# EAGLE schematic v1.4 (EAGLE 9.6.2)
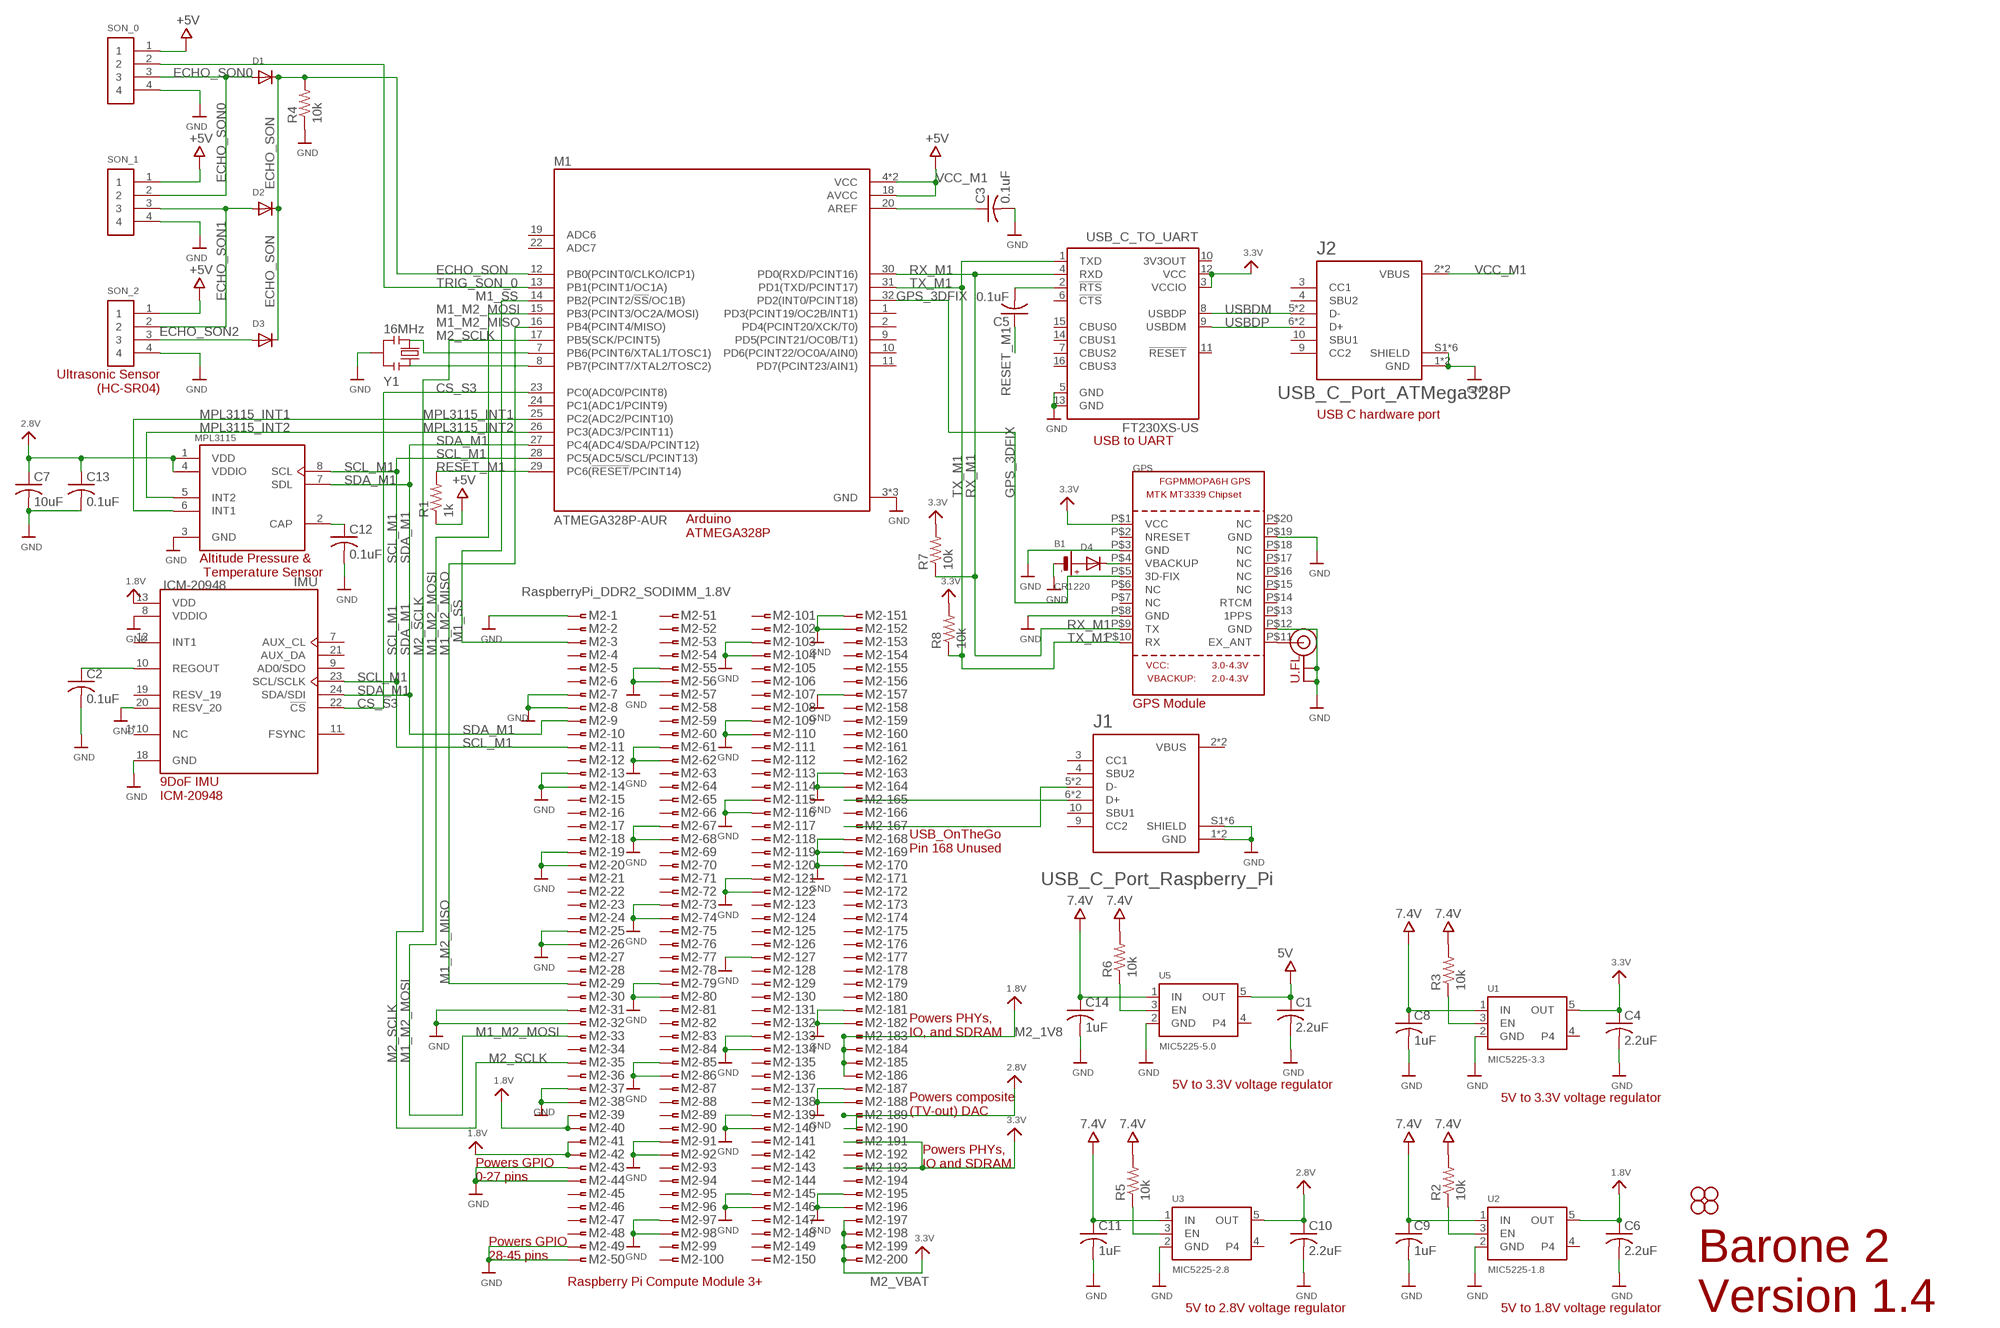
[diagram p0: schematic, sheet 1]

## Parts
B1  CR1220  BATTERYCR1220_SMT  [CR1220]
C1  2.2uF  C-USC0805  [C0805]
C2  0.1uF  C-USC0805  [C0805]
C3  0.1uF  C-USC0805  [C0805]
C4  2.2uF  C-USC0805  [C0805]
C5  0.1uF  C-USC0805  [C0805]
C6  2.2uF  C-USC0805  [C0805]
C7  10uF  C-USC0805  [C0805]
C8  1uF  C-USC0805  [C0805]
C9  1uF  C-USC0805  [C0805]
C10  2.2uF  C-USC0805  [C0805]
C11  1uF  C-USC0805  [C0805]
C12  0.1uF  C-USC0805  [C0805]
C13  0.1uF  C-USC0805  [C0805]
C14  1uF  C-USC0805  [C0805]
D1  DIODESOD-323F  [SOD-323F]
D2  DIODESOD-323F  [SOD-323F]
D3  DIODESOD-323F  [SOD-323F]
D4  DIODESOD-323F  [SOD-323F]
GPS  GPS_FGPMMOPA6H  [FGPMMOPA6H]
H1  STAND-OFF  [STAND-OFF]
H2  STAND-OFF  [STAND-OFF]
H3  STAND-OFF  [STAND-OFF]
H4  STAND-OFF  [STAND-OFF]
IMU  ICM-20948  [QFN40P300X300X105-24N]
J1  USB_C_Port_Raspberry_Pi  DX07S016JA1R1500  [JAE_DX07S016JA1R1500]
J2  USB_C_Port_ATMega328P  DX07S016JA1R1500  [JAE_DX07S016JA1R1500]
M1  ATMEGA328P-AUR  [QFP80P900X900X120-32N]
M2  RaspberryPi_DDR2_SODIMM_1.8V  1376408-SLOT_1.8V  [SLOT-1376408-1_1.8V]
MPL3115  MPL3115A2  [PSON125P300X500X120-8N]
R1  1k  R-US_R0805W  [R0805W]
R2  10k  R-US_R0805W  [R0805W]
R3  10k  R-US_R0805W  [R0805W]
R4  10k  R-US_R0805W  [R0805W]
R5  10k  R-US_R0805W  [R0805W]
R6  10k  R-US_R0805W  [R0805W]
R7  10k  R-US_R0805W  [R0805W]
R8  10k  R-US_R0805W  [R0805W]
SON_0  1X4-BIG  [1X04-BIG]
SON_1  1X4-BIG  [1X04-BIG]
SON_2  1X4-BIG  [1X04-BIG]
U1  MIC5225-3.3  VREG_SOT23-5  [SOT23-5]
U2  MIC5225-1.8  VREG_SOT23-5  [SOT23-5]
U3  MIC5225-2.8  VREG_SOT23-5  [SOT23-5]
U5  MIC5225-5.0  VREG_SOT23-5  [SOT23-5]
U.FL  U.FL  [U.FL]
USB_C_TO_UART  FT230XS-US  [SSOP16]
Y1  16MHz  0011_CSTCE16M0V53-R0  [RESONATOR]

## Nets
+5V: C14.1 R1.1 R2.2 R3.2 R5.2 R6.2 SON_0.1 SON_1.1 SON_2.1 U5.1(IN) ; supply symbol labelled 7.4V
CS_S3: IMU.22(!CS) M1.23(PC0(ADC0/PCINT8))
ECHO_SON: D1.C D2.C D3.C M1.12(PB0(PCINT0/CLKO/ICP1)) R4.2
ECHO_SON0: D1.A SON_0.3 SON_1.2
ECHO_SON1: D2.A SON_1.3 SON_2.2
ECHO_SON2: D3.A SON_2.3
GND: B1.- C1.2 C2.2 C3.2 C4.2 C6.2 C7.2 C8.2 C9.2 C10.2 C11.2 C12.2 C13.2 C14.2 GPS.P$3(GND) GPS.P$8(GND) GPS.P$19(GND) IMU.8(VDDIO) IMU.18(GND) IMU.20(RESV_20) J1.1(GND) J1.12(GND) J1.S1(SHIELD) J1.S2(SHIELD) J1.S3(SHIELD) J1.S4(SHIELD) J1.S5(SHIELD) J1.S6(SHIELD) J2.1(GND) J2.12(GND) J2.S1(SHIELD) J2.S2(SHIELD) J2.S3(SHIELD) J2.S4(SHIELD) J2.S5(SHIELD) J2.S6(SHIELD) M1.3(GND) M1.5(GND) M1.21(GND) M2.1 M2.7 M2.8 M2.13 M2.14 M2.19 M2.20 M2.25 M2.26 M2.31 M2.32 M2.37 M2.38 M2.43 M2.44 M2.49 M2.50 M2.55 M2.56 M2.61 M2.62 M2.67 M2.68 M2.73 M2.74 M2.79 M2.80 M2.85 M2.86 M2.91 M2.92 M2.97 M2.98 M2.103 M2.104 M2.109 M2.110 M2.115 M2.116 M2.121 M2.122 M2.127 M2.133 M2.134 M2.139 M2.140 M2.145 M2.146 M2.151 M2.152 M2.157 M2.163 M2.164 M2.168 M2.169 M2.170 M2.181 M2.182 M2.187 M2.188 M2.195 M2.196 MPL3115.3(GND) R4.1 SON_0.4 SON_1.4 SON_2.4 U1.2(GND) U2.2(GND) U3.2(GND) U5.2(GND) USB_C_TO_UART.5(GND) USB_C_TO_UART.13(GND) Y1.2
GPS_3DFIX: GPS.P$5(3D-FIX) M1.32(PD2(INT0/PCINT18))
M1_M2_MISO: M1.16(PB4(PCINT4/MISO)) M2.29
M1_M2_MOSI: M1.15(PB3(PCINT3/OC2A/MOSI)) M2.33
M1_SS: M1.14(PB2(PCINT2/!SS!/OC1B)) M2.3
M2_1V8: M2.183 M2.184 M2.185 M2.186 ; supply symbol labelled 1.8V
M2_SCLK: M1.17(PB5(SCK/PCINT5)) M2.35
M2_VBAT: M2.197 M2.198 M2.199 M2.200 ; supply symbol labelled 3.3V
MPL3115_INT1: M1.25(PC2(ADC2/PCINT10)) MPL3115.6(INT1)
MPL3115_INT2: M1.26(PC3(ADC3/PCINT11)) MPL3115.5(INT2)
N$1: C3.1 M1.20(AREF)
N$2: GPS.P$12(GND) U.FL.P$1(GND) U.FL.P$2(GND) ; supply symbol labelled GND
N$3: GPS.P$11(EX_ANT) U.FL.P$3(SIGNAL)
N$4: R3.1 U1.3(EN)
N$5: B1.+$1(+) B1.+$2(+) D4.A
N$6: R2.1 U2.3(EN)
N$7: J1.6(D+) J1.7(D+) M2.165
N$8: J1.5(D-) J1.8(D-) M2.167
N$9: M2.39 M2.40 ; supply symbol labelled 1.8V
N$10: C12.1 MPL3115.2(CAP)
N$11: R6.1 U5.3(EN)
N$12: R5.1 U3.3(EN)
N$15: M2.41 M2.42 ; supply symbol labelled 1.8V
N$16: C8.1 U1.1(IN) ; supply symbol labelled 7.4V
N$17: C5.2 USB_C_TO_UART.2(!RTS)
N$19: C9.1 U2.1(IN) ; supply symbol labelled 7.4V
N$20: C11.1 U3.1(IN) ; supply symbol labelled 7.4V
N$21: D4.C GPS.P$4(VBACKUP)
N$23: M1.7(PB6(PCINT6/XTAL1/TOSC1)) Y1.3
N$24: M1.8(PB7(PCINT7/XTAL2/TOSC2)) Y1.1
N$32: C2.1 IMU.10(REGOUT)
OUT: C1.1 C4.1 C6.1 C10.1 U1.5(OUT) U2.5(OUT) U3.5(OUT) U5.5(OUT) ; supply symbol labelled 3.3V, 1.8V, 2.8V, 5V
RESET_M1: C5.1 M1.29(PC6(!RESET!/PCINT14)) R1.2
RX_M1: GPS.P$9(TX) M1.30(PD0(RXD/PCINT16)) R7.1 USB_C_TO_UART.4(RXD)
SCL_M1: IMU.23(SCL/SCLK) M1.28(PC5(ADC5/SCL/PCINT13)) M2.11 MPL3115.8(SCL)
SDA_M1: IMU.24(SDA/SDI) M1.27(PC4(ADC4/SDA/PCINT12)) M2.9 MPL3115.7(SDL)
TRIG_SON_0: M1.13(PB1(PCINT1/OC1A)) SON_0.2
TX_M1: GPS.P$10(RX) M1.31(PD1(TXD/PCINT17)) R8.1 USB_C_TO_UART.1(TXD)
USBDM: J2.5(D-) J2.8(D-) USB_C_TO_UART.8(USBDP)
USBDP: J2.6(D+) J2.7(D+) USB_C_TO_UART.9(USBDM)
VCC_M1: J2.2(VBUS) J2.11(VBUS) M1.4(VCC) M1.6(VCC) M1.18(AVCC) ; supply symbol labelled +5V
VIN: C7.1 C13.1 GPS.P$1(VCC) IMU.13(VDD) M2.189 M2.190 M2.191 M2.193 MPL3115.1(VDD) MPL3115.4(VDDIO) R7.2 R8.2 USB_C_TO_UART.3(VCCIO) USB_C_TO_UART.12(VCC) ; supply symbol labelled 3.3V, 2.8V, 1.8V
Unconnected: GPS.P$2(NRESET) GPS.P$6(NC) GPS.P$7(NC) GPS.P$13(1PPS) GPS.P$14(RTCM) GPS.P$15(NC) GPS.P$16(NC) GPS.P$17(NC) GPS.P$18(NC) GPS.P$20(NC) IMU.1(NC) IMU.2(NC) IMU.3(NC) IMU.4(NC) IMU.5(NC) IMU.6(NC) IMU.7(AUX_CL) IMU.9(AD0/SDO) IMU.11(FSYNC) IMU.12(INT1) IMU.14(NC) IMU.15(NC) IMU.16(NC) IMU.17(NC) IMU.19(RESV_19) IMU.21(AUX_DA) J1.3(CC1) J1.4(SBU2) J1.9(CC2) J1.10(SBU1) J2.3(CC1) J2.4(SBU2) J2.9(CC2) J2.10(SBU1) M1.1(PD3(PCINT19/OC2B/INT1)) M1.2(PD4(PCINT20/XCK/T0)) M1.9(PD5(PCINT21/OC0B/T1)) M1.10(PD6(PCINT22/OC0A/AIN0)) M1.11(PD7(PCINT23/AIN1)) M1.19(ADC6) M1.22(ADC7) M1.24(PC1(ADC1/PCINT9)) M2.2 M2.4 M2.5 M2.6 M2.10 M2.12 M2.15 M2.16 M2.17 M2.18 M2.21 M2.22 M2.23 M2.24 M2.27 M2.28 M2.30 M2.34 M2.36 M2.45 M2.46 M2.47 M2.48 M2.51 M2.52 M2.53 M2.54 M2.57 M2.58 M2.59 M2.60 M2.63 M2.64 M2.65 M2.66 M2.69 M2.70 M2.71 M2.72 M2.75 M2.76 M2.77 M2.78 M2.81 M2.82 M2.83 M2.84 M2.87 M2.88 M2.89 M2.90 M2.93 M2.94 M2.95 M2.96 M2.99 M2.100 M2.101 M2.102 M2.105 M2.106 M2.107 M2.108 M2.111 M2.112 M2.113 M2.114 M2.117 M2.118 M2.119 M2.120 M2.123 M2.124 M2.125 M2.126 M2.128 M2.129 M2.130 M2.131 M2.132 M2.135 M2.136 M2.137 M2.138 M2.141 M2.142 M2.143 M2.144 M2.147 M2.148 M2.149 M2.150 M2.153 M2.154 M2.155 M2.156 M2.158 M2.159 M2.160 M2.161 M2.162 M2.166 M2.171 M2.172 M2.173 M2.174 M2.175 M2.176 M2.177 M2.178 M2.179 M2.180 M2.192 M2.194 U1.4 U2.4 U3.4 U5.4 USB_C_TO_UART.6(!CTS) USB_C_TO_UART.7(CBUS2) USB_C_TO_UART.10(3V3OUT) USB_C_TO_UART.11(!RESET) USB_C_TO_UART.14(CBUS1) USB_C_TO_UART.15(CBUS0) USB_C_TO_UART.16(CBUS3)

## Notes on the sheet
- Ultrasonic Sensor
  (HC-SR04)
- USB C hardware port
- USB to UART
- Arduino
  ATMEGA328P
- Altitude Pressure &
   Temperature Sensor
- U.FL
- GPS Module
- 9DoF IMU
  ICM-20948
- USB_OnTheGo
  Pin 168 Unused
- Powers PHYs, 
  IO, and SDRAM
- 5V to 3.3V voltage regulator
- 5V to 3.3V voltage regulator
- Powers composite
  (TV-out) DAC
- Powers PHYs, 
  IO and SDRAM
- Powers GPIO 
  0-27 pins
- Powers GPIO 
  28-45 pins
- Raspberry Pi Compute Module 3+
- 5V to 2.8V voltage regulator | 5V to 1.8V voltage regulator
- Barone 2
  Version 1.4

## Power pins joined to a net without a drawn wire
VBUS: J1.2(VBUS) J1.11(VBUS)

## Library data of the parts
B1 = microbuilder:BATTERY: CR1220 SMT - Digikey: 3001K-ND CD2032 BAT-HLD-001 - Digikey: BAT-HLD-001-ND
C1-C14 = rcl:C-US: CAPACITOR, American symbol; SPICEPREFIX: C
D1-D4 = adafruit:DIODE: Diode SMADIODE - SMA Surface Mount Package 20V 1A Schottky Diode Digikey: 641-1014-6-ND DO-1N4148 - Through Hole Small Current Diode SOD-123 20V 1 A (.5mV Vf) Schottky Diode - Digikey: MBRX120TPMSCT-ND SOD-323 10V 570mA (.38mV Vf, 3ns) Schottky Diode - Digikey: ZLLS410CT-ND SOD-523 30V 30mA Schottky Diode (RB751S-40TE61) - Digikey: RB751S-40TE61CT-ND SOT23-R/W - SOT23 Package (R = Solder Paste/Reflow Ovens, W = Hand-Soldering) BAT54Film 40V 300mA - Digikey: 497-7162-1-ND
GPS = adafruit:GPS_FGPMMOPA6H: GPS Module - MTK MT3339 Chipset, -165dBm sensitivity, 22 channels, 10Hz, auto-select external antenna options
H1-H4 = SparkFun-Hardware:STAND-OFF: Stand Off Drill holes for mechanically mounting via screws, standoffs, etc. Note: Use the keepout ring to avoid running the screw head into surrounding components. Variant Overviews STAND-OFF - Mechanical footprint for a #4 phillips button head screw. STAND-OFF-TIGHT - Mechanical footprint for a #4 phillips button head screw, Example SparkFun Products Screw - Phillips Head (1/4", 4-40, 10 pack) <https://www.sparkfun.com/products/10453> (PRT-10453) Screw - Phillips Head (1/2", 4-40, 10 pack) <https://www.sparkfun.com/products/10452> (PRT-10452) Screw - Phillips Head (3/4", 4-40, 10 pack) <https://www.sparkfun.com/products/10451> (PRT-10451) Screw - Phillips Head (1", 4-40, 10 pack) <https://www.sparkfun.com/products/10450> (PRT-10450)
IMU = ICM-20948:ICM-20948: Accelerometer, Gyroscope, Magnetometer, 9 Axis Sensor I²C, SPI Output Check prices <https://pricing.snapeda.com/parts/ICM-20948/TDK%20InvenSense/view-part?ref=eda>; AVAILABILITY: Good; DESCRIPTION: Accelerometer, Gyroscope, Magnetometer, 9 Axis Sensor I²C, SPI Output; MF: TDK InvenSense; MP: ICM-20948; PACKAGE: TFQFN-24 TDK InvenSense; PRICE: None; PURCHASE-URL: https://pricing.snapeda.com/search/part/ICM-20948/?ref=eda
J1 J2 = DX07S016JA1R1500:DX07S016JA1R1500: USB-C (USB TYPE-C) USB 2.0 Receptacle Connector 24 (16+8 Dummy) Position Surface Mount, Right Angle; Through Hole Check prices <https://pricing.snapeda.com/parts/DX07S016JA1R1500/JAE%20Electronics/view-part?ref=eda>; AVAILABILITY: Warning; DESCRIPTION: USB-C (USB TYPE-C) USB 2.0 Receptacle Connector 24 (16+8 Dummy) Position Surface Mount, Right Angle; Through Hole; MF: JAE Electronics; MP: DX07S016JA1R1500; PACKAGE: None; PRICE: None; PURCHASE-URL: https://pricing.snapeda.com/search/part/DX07S016JA1R1500/?ref=eda
M1 = ATMEGA328P-AUR:ATMEGA328P-AUR: ATmega328P Series 8 Bit 2 kB RAM 32 kB Flash SMT Microcontroller - TQFP-32 Check prices <https://pricing.snapeda.com/parts/ATMEGA328P-AUR/Microchip/view-part?ref=eda>; AVAILABILITY: Good; DESCRIPTION: AVR AVR® ATmega Microcontroller IC 8-Bit 20MHz 32KB (16K x 16) FLASH 32-TQFP (7x7); MF: Microchip; MP: ATMEGA328P-AUR; PACKAGE: TQFP-32 Microchip; PRICE: None; PURCHASE-URL: https://pricing.snapeda.com/search/part/ATMEGA328P-AUR/?ref=eda
M2 = con-amp:1376408: DDR1 & DDR2 SODIMM SOCKET 0.6mm Pitch 200 Pos. Standard Profile, Standard Type (used on Kontron X-Board) Source: http://catalog.tycoelectronics.com .. JPN_CD_1376408_S.pdf
MPL3115 = MPL3115A2:MPL3115A2: Pressure Sensor, 50-110kpa, Lga-8 Check prices <https://pricing.snapeda.com/parts/MPL3115A2/NXP%20Semiconductors/view-part?ref=eda>; AVAILABILITY: Good; DESCRIPTION: Pressure Sensor 7.25PSI ~ 15.95PSI (50kPa ~ 110kPa) Absolute 24 b 8-TLGA; MF: NXP Semiconductors; MP: MPL3115A2; PACKAGE: TLGA-8 NXP Semiconductors; PRICE: None; PURCHASE-URL: https://pricing.snapeda.com/search/part/MPL3115A2/?ref=eda
R1-R8 = adafruit:R-US_: RESISTOR, American symbol
SON_0 SON_1 SON_2 = adafruit:1X4: 4-pin connector
U1-U3 U5 = microbuilder:VREG_SOT23-5: SOT23-5 Fixed Voltage Regulators Part Current Out V Out V In V Dropout θJA (°C/W) TJ (°C) Digikey Part No. ADP121 150mA 3.3V 3.4-5.5V 0.09V @ 150mA -- -- ADP121-AUJZ33R7CT-ND ADP121 150mA 3.0V 3.1-5.5V 0.09V @ 150mA -- -- ADP121-AUJZ30R7CT-ND ADP122 300mA 3.3V 3.4-5.5V 0.085V @ 300mA -- -- ADP122AUJZ-3.3-R7CT-ND ADP1712 300mA 3.3V 3.5-5.5V 0.17V @ 300mA -- -- ADP1712AUJZ-3.3-R7TR-ND AP7311 (Low Cost) 150mA 3.3V 3.5-6V 0.15V @ 150mA -- -- AP7311-33WG-7DICT-ND LD39015M18R 150mA 1.8V 1.9V-5.5V 0.08V @ 100mA -- -- 497-6977-1-ND LP2985A-33DBVR 150mA 3.3V 3.3-16V 0.28V @ 150mA 206 150 296-18479-1-ND MCP1824T-3302E/OT 300mA 3.3V 3.5V-6V 0.2V @ 300mA -- -- MCP1824T-3302E/OTCT-ND MIC5205-2.5YM5 TR 150mA 2.5V 2.7-16V 0.165V @ 150mA -- -- 576-1257-2-ND MIC5205-3.0YM5 TR 150mA 3.0V 3.2V-16V 0.165V @ 150mA -- -- 576-1258-2-ND MIC5205-3.3YM5 TR 150mA 3.3V 3.5V-16V 0.165V @ 150mA -- -- 576-1259-2-ND TPS780330220 150mA 3.3V+2.2V 3.6-5.5V 250mV Max -- -- 296-23332-1-ND TDA3663/N1,135 100mA 3.3V 3.5-45V 0.18V @ 50mA -- -- 568-5343-1-ND Max operating temp can be calculated using θJA, TJ (max junction temperature), and power in watts. Set the "Maximum Ambient Temperature" until it reaches TJ ("Max Junction Temperature"), which is the absolute limit for safe use of the regulator: Heat Sink Temperature Calculator <http://www.daycounter.com/Calculators/Heat-Sink-Temperature-Calculator.phtml> For example, With 12V source into a 3.3V LP2985 and a 30mA load, we are dissipating (12V-3.3V) * 0.03A = 0.261W. With a θJA of 206 °C/W, a TJ of 150°C, and 261mW we can safely use the chip without a heat sink up to 75°C (=147.1°C Junction Temperature).
U.FL = microbuilder:U.FL: U.FL Antenna Connector
USB_C_TO_UART = FT230XS-U:FT230XS-U: USB to BASIC UART IC Auto generated by make-symbol-device-package-bsdl.ulp Rev. 43 Source: Data sheet <http://www.ftdichip.com/Support/Documents/DataSheets/ICs/DS_FT230X.pdf> Check prices <https://pricing.snapeda.com/parts/FT230XS-U/FTDI%2C/view-part?ref=eda>; AVAILABILITY: Warning; DESCRIPTION: USB Bridge, USB to UART USB 2.0 UART Interface 16-SSOP; MF: FTDI,; MP: FT230XS-U; PACKAGE: SSOP-16 FTDI,; PRICE: None; PURCHASE-URL: https://pricing.snapeda.com/search/part/FT230XS-U/?ref=eda
Y1 = Cristalli:0011_CSTCE16M0V53-R0: 16Mhz - SMD; MONTHLY_USAGE: _____; PART_NUMBER: CSTCE16M0V53-R0; PRICE: _____; SUPPLIER: _____; TYPE: Cristalli; VALUE: CSTCE16M0V53-R0